# EAGLE schematic expboard (EAGLE 5.11)
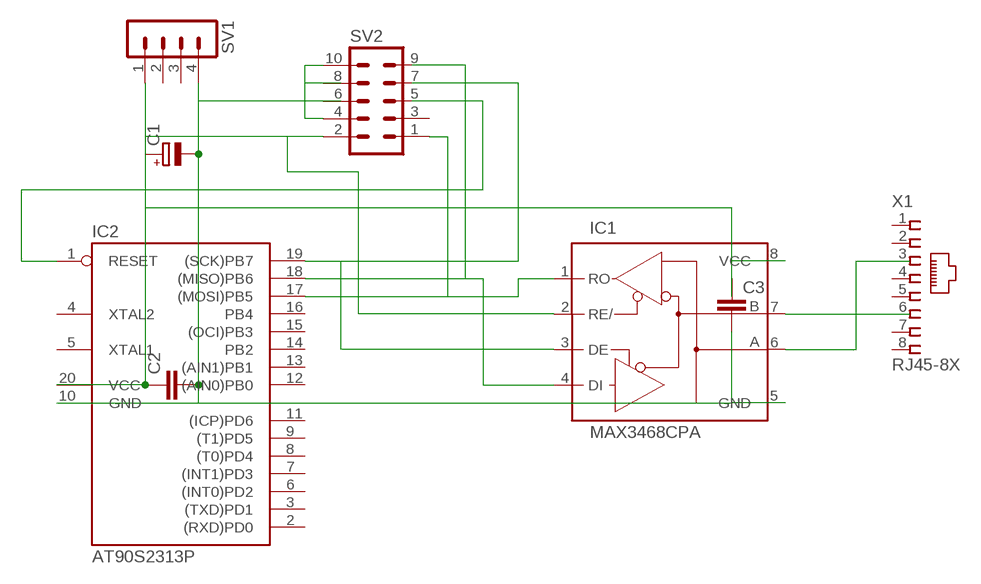
[diagram p0: schematic, sheet 1]

## Parts
C1  CPOL-EUE2.5-6  [E2,5-6]
C2  C-EU025-025X050  [C025-025X050]
C3  C-EU025-025X050  [C025-025X050]
IC1  MAX3468CPA  [DIL08]
IC2  AT90S2313P  [DIL20]
SV1  MA04-1  [MA04-1]
SV2  MA05-2  [MA05-2]
X1  RJ45-8X  [RJ45-NO-SHIELD]

## Nets
N$2: IC1.6(A)
N$3: IC1.4(DI) IC2.18((MISO)PB6)
N$4: IC1.1(RO) IC2.17((MOSI)PB5) SV2.1
N$5: IC2.1(RESET)
N$6: IC1.3(DE) IC2.19((SCK)PB7)
N$7: C1.- C2.2 C3.2 IC1.5(GND) IC2.10(GND) SV1.4 SV2.4 SV2.10
N$8: IC1.7(B)
N$9: C1.+ C2.1 IC1.2(RE/) IC1.8(VCC) IC2.20(VCC) SV1.1 SV2.2
Unconnected: C3.1 IC2.2((RXD)PD0) IC2.3((TXD)PD1) IC2.4(XTAL2) IC2.5(XTAL1) IC2.6((INT0)PD2) IC2.7((INT1)PD3) IC2.8((T0)PD4) IC2.9((T1)PD5) IC2.11((ICP)PD6) IC2.12((AIN0)PB0) IC2.13((AIN1)PB1) IC2.14(PB2) IC2.15((OCI)PB3) IC2.16(PB4) SV1.2 SV1.3 SV2.3 SV2.5 SV2.6 SV2.7 SV2.8 SV2.9 X1.1 X1.2 X1.3 X1.4 X1.5 X1.6 X1.7 X1.8

## Library data of the parts
C1 = rcl:CPOL-EU: POLARIZED CAPACITOR, European symbol
C2 C3 = rcl:C-EU: CAPACITOR, European symbol
IC1 = maxim:MAX34*: +5V, Fail-Safe, 40Mbps, Profibus RS-485/RS-422 Transceivers Source: MAX3465-MAX3469.pdf; OC_FARNELL: unknown; OC_NEWARK: unknown
IC2 = avr-5:AT90S2313: MICROCONTROLLER 2 Kbytes FLASH 128 bytes SRAM 128 bytes EEPROM UART
SV1 = con-lstb:MA04-1: PIN HEADER; OC_FARNELL: unknown; OC_NEWARK: unknown
SV2 = con-lstb:MA05-2: PIN HEADER; OC_FARNELL: unknown; OC_NEWARK: unknown
X1 = con-tycoelectronics:RJ45: CORCOM Modular RJ Jacks No Shield Source: www.tycoelectronics.com .. ENG_DS_1654001_1099_RJ_L_0507.pdf; MPN: RJ45-8X; OC_FARNELL: unknown; OC_NEWARK: 16R6101